# Altium schematic sheet PM12_LDO.SchDoc: FIT_PM12 board
size 420 x 297 mm; CheckedBy: G.Kasprowicz; Author: INR Moscow; CompanyName: WUT ISE; DrawnBy: M.Podgórski; Organization: WUT ISE; Address1: PW ISE; Address2: Nowowiejska 15/19 00-665 Warsaw; Address3: gkasprow@gmail.com; DocumentNumber: 12; Revision: 2; SheetNumber: 14; SheetTotal: 34; ModifiedBy: -; CheckedDate: -; Title2: LDOs; DivGrp: WUT ISE; Designer: INR RAS; ModifiedDate: -; ProjectName: Sensor Box
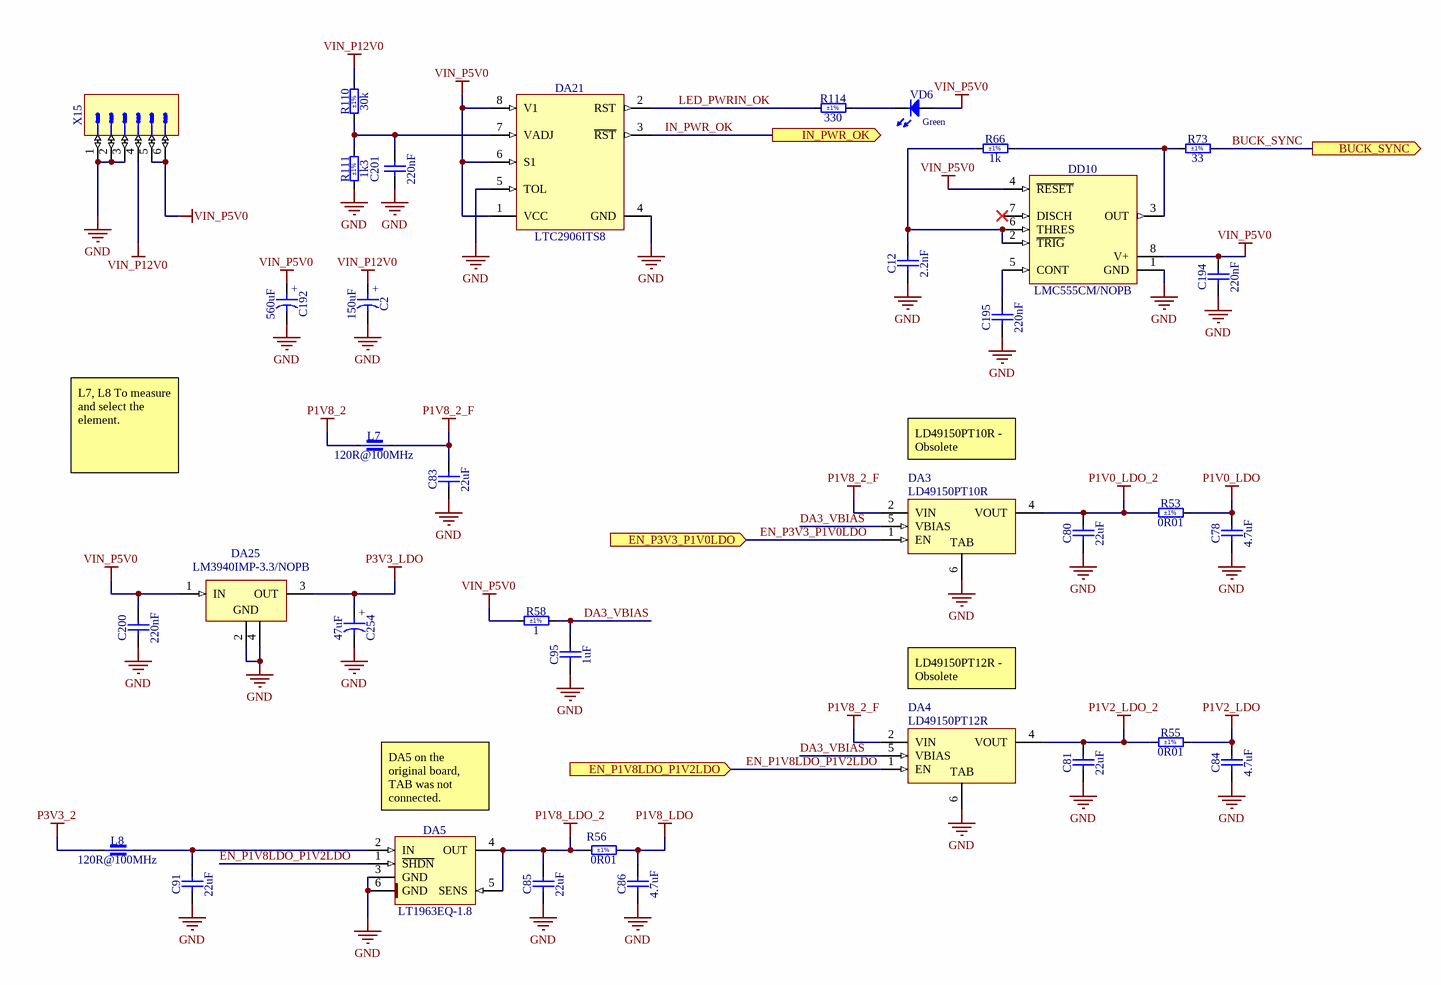
[diagram p0: PM12_LDO.SchDoc]

## Parts
C2  150uF  [CAPAE830X1020N]
C12  2.2nF  [CAPC2013X100N]
C78  4.7uF  [CAPC2012X145N]
C80  22uF  [CAPC3216X180N]
C81  22uF  [CAPC3216X180N]
C83  22uF  [CAPC3216X180N]
C84  4.7uF  [CAPC2012X145N]
C85  22uF  [CAPC3216X180N]
C86  4.7uF  [CAPC2012X145N]
C91  22uF  [CAPC3216X180N]
C95  1uF  [CAPC2012X140N]
C192  560uF  [CAPAE830X1020N]
C194  220nF  [CAPC2012X135N]
C195  220nF  [CAPC2012X135N]
C200  220nF  [CAPC2012X135N]
C201  220nF  [CAPC2012X135N]
C254  47uF  [CAPAE530X610N]
DA3  LD49150PT10R  [PPAK_N]
DA4  LD49150PT12R  [PPAK_M]
DA5  LT1963EQ-1.8  [TO170P1394X457-6N-R900X1060]
DA21  LTC2906ITS8  [SOT65P280X100-8N]
DA25  LM3940IMP-3.3/NOPB  [SOT230P700X180-4N]
DD10  LMC555CM/NOPB  [SOIC127P600X175-8N]
L7  120R@100MHz  [IND_MURATA_BLM31KN]
L8  120R@100MHz  [IND_MURATA_BLM31KN]
R53  0R01  Tolerance: ±1%  [RESC3216X80N]
R55  0R01  Tolerance: ±1%  [RESC3216X80N]
R56  0R01  Tolerance: ±1%  [RESC3216X80N]
R58  1  Tolerance: ±1%  [RESC2012X60N]
R66  1k  Tolerance: ±1%  [RESC2012X60N]
R73  33  Tolerance: ±1%  [RESC2012X60N]
R110  30k  Tolerance: ±1%  [RESC2012X60N]
R111  1k3  Tolerance: ±1%  [RESC2012X60N]
R114  330  Tolerance: ±1%  [RESC2012X60N]
VD6  Green  [LED_KINGBRIGHT_KP-2012LSGC]
X15  Mini-Fit BMI  [MOLEX_15-24-9067]  (value not drawn)

## Ports
BUCK_SYNC (out), EN_P1V8LDO_P1V2LDO (in), EN_P3V3_P1V0LDO (in), IN_PWR_OK (out)

## Nets
GND: C2.2 C12.1 C78.1 C80.1 C81.1 C83.1 C84.1 C85.1 C86.1 C91.1 C95.1 C192.2 C194.1 C195.1 C200.1 C201.1 C254.2 DA3.6(TAB) DA4.6(TAB) DA5.3(GND) DA5.6(GND) DA21.4(GND) DA21.5(TOL) DA25.2(GND) DA25.4(GND) DD10.1(GND) R111.1 X15.1 X15.2 X15.3
P1V0_LDO: C78.2 R53.2
P1V0_LDO_2: C80.2 DA3.4(VOUT) R53.1
P1V2_LDO: C84.2 R55.2
P1V2_LDO_2: C81.2 DA4.4(VOUT) R55.1
P1V8_2: L7.1
P1V8_2_F: C83.2 DA3.2(VIN) DA4.2(VIN) L7.2
P1V8_LDO: C86.2 R56.2
P1V8_LDO_2: C85.2 DA5.4(OUT) DA5.5(SENS) R56.1
P3V3_2: L8.1
P3V3_LDO: C254.1 DA25.3(OUT)
VIN_P5V0: C192.1 C194.2 C200.2 DA21.1(VCC) DA21.6(S1) DA21.8(V1) DA25.1(IN) DD10.4(~{RESET}) DD10.8(V+) R58.1 VD6.2(A) X15.5 X15.6
VIN_P12V0: C2.1 R110.2 X15.4
BUCK_SYNC: R73.2 ; port BUCK_SYNC
DA3_VBIAS: C95.2 DA3.5(VBIAS) DA4.5(VBIAS) R58.2
EN_P1V8LDO_P1V2LDO: DA4.1(EN) DA5.1(~{SHDN}) ; port EN_P1V8LDO_P1V2LDO
EN_P3V3_P1V0LDO: DA3.1(EN) ; port EN_P3V3_P1V0LDO
IN_PWR_OK: DA21.3(~{RST}) ; port IN_PWR_OK
LED_PWRIN_OK: DA21.2(RST) R114.1
NetC12_2: C12.2 DD10.2(~{TRIG}) DD10.6(THRES) R66.1
NetC91_2: C91.2 DA5.2(IN) L8.2
NetC195_2: C195.2 DD10.5(CONT)
NetC201_2: C201.2 DA21.7(VADJ) R110.1 R111.2
NetDD10_3: DD10.3(OUT) R66.2 R73.1
NetR114_2: R114.2 VD6.1(C)

Not connected (* = marked no-connect by the designer): DD10 7(DISCH)*

## Notes on the sheet
- L7, L8 To measure and select the element.
- LD49150PT10R - Obsolete
- LD49150PT12R - Obsolete
- (near DA5) DA5 on the original board, TAB was not connected.
- Project/Equipment
- Document
- Designer
- Drawn by
- Check.by
- Copyright WUT ISE 2024.
  This documentation describes Open Hardware and is licensed under the CERN OHL v.2. You may redistribute and modify this documentation under the terms of the CERN OHL v.2. (http://ohwr.org/CERNOHL). This documentation is distributed WITHOUT ANY EXPRESS OR IMPLIED WARRANTY, INCLUDING OF MERCHANTABILITY, SATISFACTORY QUALITY AND FITNESS FOR A PARTICULAR PURPOSE. Please see the CERN OHL v.2 for applicable conditions.
- Contact
- File
- Last Mod.
- Print Date
- Sheet
- Size
- A3
- of
- Rev
- (in symbol CAE530-610_47UF_16V_20%) +
- (in symbol CAE830-1020_150UF_25V_20%) +
- (in symbol CAE830-1020_560UF_10V_20%) +

## Library data of the parts
C2 = CAE830-1020_150UF_25V_20%: Polarised capacitor; Part Description: Aluminum Electrolytic SMT Capacitor; Manufacturer: PANASONIC; Manufacturer Part Number: EEEFP1E151AP; Voltage: 25V; Tolerance: ±20%; Part Number: CAE830-1020_150UF_25V_20%; Component Kind: Standard; Component Type: Standard; Pin Count: 2; Value: 150uF; Status: Not Recommended; Case: F; Mounted: Yes; Socket: No; SMD: Yes; Sense: No; ComponentHeight: 10.2mm; HelpURL: \\cern.ch\dfs\Applications\Altium\Datasheets\CAE_PANASONIC_FP.pdf; Author: CERN DEM HF; CreateDate: 24.05.2024; LatestRevisionDate: 24.05.2024
C12 = CC0805_2.2NF_50V_5%_C0G: Non-polarised capacitor; Part Description: SMD Multilayer Chip Ceramic Capacitor; Manufacturer: GENERIC; Manufacturer1 Part Number: C0805C222J5GACTU; Voltage: 50V; TC: C0G/NP0; Tolerance: ±5%; Part Number: CC0805_2.2NF_50V_5%_C0G; Component Kind: Standard; Component Type: Standard; Pin Count: 2; Value: 2.2nF; Status: None; Manufacturer Part Number: CC0805_2.2NF_50V_5%_C0G; Case: 0805; Mounted: Yes; Socket: No; SMD: Yes; Sense: No; Manufacturer1 Example: KEMET; Manufacturer1 ComponentHeight: 0.88mm; HelpURL: \\cern.ch\dfs\Applications\Altium\Datasheets\CC0805_C0G_KEMET_(Commercial Grade).pdf; Author: CERN DEM MR; CreateDate: 26.01.2016; LatestRevisionDate: 26.01.2016
C78 C84 C86 = CC0805_4.7UF_50V_10%_X7R: Non-polarised capacitor; Part Description: SMD Multilayer Chip Ceramic Capacitor; Manufacturer: GENERIC; Manufacturer1 Part Number: C2012X7R1H475K125; Voltage: 50V; TC: X7R; Tolerance: ±10%; Part Number: CC0805_4.7UF_50V_10%_X7R; Component Kind: Standard; Component Type: Standard; Pin Count: 2; Value: 4.7uF; Status: Preferred; Manufacturer Part Number: CC0805_4.7UF_50V_10%_X7R; Case: 0805; Mounted: Yes; Socket: No; SMD: Yes; Sense: No; Manufacturer1 Example: TDK; Manufacturer1 ComponentHeight: 1.45mm; HelpURL: \\cern.ch\dfs\Applications\Altium\Datasheets\CC0805_X7R_TDK_C.pdf; Author: CERN DEM JMW; CreateDate: 30.07.2021; LatestRevisionDate: 30.07.2021
C80 C81 C83 C85 C91 = CC1206_22UF_25V_20%_X5R: Non-polarised capacitor; Part Description: SMD Multilayer Chip Ceramic Capacitor; Manufacturer: GENERIC; Manufacturer1 Part Number: C3216X5R1E226M160; Voltage: 25V; TC: X5R; Tolerance: ±20%; Part Number: CC1206_22UF_25V_20%_X5R; Component Kind: Standard; Component Type: Standard; Pin Count: 2; Value: 22uF; Status: None; Manufacturer Part Number: CC1206_22UF_25V_20%_X5R; Case: 1206; Mounted: Yes; Socket: No; SMD: Yes; Sense: No; Manufacturer1 Example: TDK; Manufacturer1 ComponentHeight: 1.8mm; HelpURL: \\cern.ch\dfs\Applications\Altium\Datasheets\CC1206_X5R_TDK_C.pdf; Author: CERN DEM WB; CreateDate: 25.07.2018; LatestRevisionDate: 25.07.2018
C95 = CC0805_1UF_25V_10%_X7R: Non-polarised capacitor; Part Description: SMD Multilayer Chip Ceramic Capacitor; Manufacturer: GENERIC; Manufacturer1 Part Number: C0805C105K3RAC; Voltage: 25V; TC: X7R; Tolerance: ±10%; Part Number: CC0805_1UF_25V_10%_X7R; Component Kind: Standard; Component Type: Standard; Pin Count: 2; Value: 1uF; Status: Preferred; Manufacturer Part Number: CC0805_1UF_25V_10%_X7R; Case: 0805; Mounted: Yes; Socket: No; SMD: Yes; Sense: No; Manufacturer1 Example: KEMET; Manufacturer1 ComponentHeight: 1.4mm; HelpURL: \\cern.ch\dfs\Applications\Altium\Datasheets\CC0805_X7R_KEMET.pdf; Author: CERN DEM JLC; CreateDate: 23.03.2009; LatestRevisionDate: 23.03.2009
C192 = CAE830-1020_560UF_10V_20%: Polarised capacitor; Part Description: Aluminum Electrolytic SMT Capacitor; Manufacturer: PANASONIC; Manufacturer Part Number: EEEFH1A561L; Voltage: 10V; Tolerance: ±20%; Part Number: CAE830-1020_560UF_10V_20%; Component Kind: Standard; Component Type: Standard; Pin Count: 2; Value: 560uF; Status: Not Recommended; Case: F; Mounted: Yes; Socket: No; SMD: Yes; Sense: No; ComponentHeight: 10.2mm; HelpURL: \\cern.ch\dfs\Applications\Altium\Datasheets\CAE_PANASONIC_FH.pdf; Author: CERN DEM HF; CreateDate: 24.05.2024; LatestRevisionDate: 24.05.2024
C194 C195 C200 C201 = CC0805_220NF_50V_10%_X7R: Non-polarised capacitor; Part Description: SMD Multilayer Chip Ceramic Capacitor; Manufacturer: GENERIC; Manufacturer1 Part Number: GRM21BR71H224KA01L; Voltage: 50V; TC: X7R; Tolerance: ±10%; Part Number: CC0805_220NF_50V_10%_X7R; Component Kind: Standard; Component Type: Standard; Pin Count: 2; Value: 220nF; Status: Preferred; Manufacturer Part Number: CC0805_220NF_50V_10%_X7R; Case: 0805; Mounted: Yes; Socket: No; SMD: Yes; Sense: No; Manufacturer1 Example: MURATA; Manufacturer1 ComponentHeight: 1.35mm; HelpURL: \\cern.ch\dfs\Applications\Altium\Datasheets\CC0805_X7R_MURATA.pdf; Author: CERN DEM JLC; CreateDate: 03.12.2007; LatestRevisionDate: 03.12.2007
C254 = CAE530-610_47UF_16V_20%: Polarised capacitor; Part Description: Conductive Polymer Hybrid Aluminum Electrolytic Capacitor; Manufacturer: CHEMI-CON; Manufacturer Part Number: HHXD160ARA470ME61G; Voltage: 16V; Tolerance: ±20%; Part Number: CAE530-610_47UF_16V_20%; Component Kind: Standard; Component Type: Standard; Pin Count: 2; Value: 47uF; Status: Not Recommended; Case: C; Mounted: Yes; Socket: No; SMD: Yes; Sense: No; ComponentHeight: 6.1mm; HelpURL: \\cern.ch\dfs\Applications\Altium\Datasheets\CAE_CHIMI-CON_HXD.pdf; Author: CERN DEM HF; CreateDate: 15.04.2024; LatestRevisionDate: 15.04.2024
DA3 = CMP-0244-00092-1: 1.5 Very Low Drop Voltage Regulator, 1.0V, 5-Pin PPAK, Tape and Reel; ComponentLink1URL: http://www.st.com; ComponentLink2Description: Datasheet; PackageVersion: 1/06/2004; DatasheetVersion: 1/06/2010; PackageDescription: 5-Pin Transistor Outline Package 1.27 mm Pitch, 9.7 mm Lead Span; ComponentLink1Description: Manufacturer URL; ComponentLink2URL: http://www.st.com/internet/com/TECHNICAL_RESOURCES/TECHNICAL_LITERATURE/DATASHEET/CD00157522.pdf; PackageReference: PPAK
DA4 = CMP-0244-00093-1: 1.5 Very Low Drop Voltage Regulator, 1.2V, 5-Pin PPAK, Tape and Reel; ComponentLink2URL: http://www.st.com/internet/com/TECHNICAL_RESOURCES/TECHNICAL_LITERATURE/DATASHEET/CD00157522.pdf; DatasheetVersion: 1/06/2010; ComponentLink1Description: Manufacturer URL; ComponentLink2Description: Datasheet; ComponentLink1URL: http://www.st.com; PackageDescription: 5-Pin Transistor Outline Package 1.27 mm Pitch, 9.7 mm Lead Span; PackageReference: PPAK; PackageVersion: 1/06/2004
DA5 = LT1963EQ-1.8: 1.5A, Fast Transient Response LDO Regulators; Part Description: 1.5A, 1.8V, Fast Transient Response, LDO Regulator; Manufacturer: ANALOG DEVICES; PressFit: No; Bonding: No; Part Number: LT1963EQ-1.8; Component Kind: Standard; Component Type: Standard; Device: LT1963EQ-1.8; PackageDescription: D2PAK TO-263, TO, 1.70mm Pitch; 5 Pin, 13.945mm L X 8.89mm W X 4.572mm H body, IPC Medium Density; Manufacturer Part Number: LT1963EQ-1.8; Pin Count: 6; Case: TO-263-5; Mounted: Yes; Socket: No; SMD: Yes; Sense: No; ComponentHeight: 4.57mm; HelpURL: \\cern.ch\dfs\Applications\Altium\Datasheets\LT1963.pdf; Author: CERN DEM HF; CreateDate: 05.06.2024; LatestRevisionDate: 05.06.2024
DA21 = LTC2906ITS8: Precision Dual Supply Monitors with One Pin-Selectable Threshold and One Adjustable Input; Manufacturer: LINEAR TECHNOLOGY; PressFit: No; Bonding: No; Part Number: LTC2906ITS8; Component Kind: Standard; Component Type: Standard; Device: LTC2906ITS8; PackageDescription: SOT, 0.65mm Pitch; 8 Pin, 1.625mm W X 2.90mm L X 1.00mm H Body, IPC Medium Density; Part Description: Precision Dual Supply Monitors with One Pin-Selectable Threshold and One Adjustable Input; Manufacturer Part Number: LTC2906ITS8; Pin Count: 8; Case: SOT23-8; Mounted: Yes; Socket: No; SMD: Yes; Sense: No; ComponentHeight: 1mm; Author: CERN DEM HF; HelpURL: \\cern.ch\dfs\Applications\Altium\Datasheets\LTC2906.pdf; CreateDate: 05.06.2024; LatestRevisionDate: 05.06.2024
DA25 = LM3940IMP-3.3/NOPB: 3-Terminal Regulator 1=IN 2=GND 3=OUT 4=GND; Part Description: 1A Low Dropout Regulator for 5V to 3.3V Conversion; Manufacturer: TEXAS INSTRUMENTS; PressFit: No; Bonding: No; Part Number: LM3940IMP-3.3/NOPB; Component Kind: Standard; Component Type: Standard; Device: LM3940IMP-3.3/NOPB; PackageDescription: SOT223, 2.30mm Pitch; 4 Pin, 3.70mm W X 6.70mm L X 1.80mm H body, IPC Medium Density; Manufacturer Part Number: LM3940IMP-3.3; Pin Count: 4; Case: SOT223; Mounted: Yes; Socket: No; SMD: Yes; Sense: No; ComponentHeight: 1.8mm; HelpURL: \\cern.ch\dfs\Applications\Altium\Datasheets\LM3940IMP-3.3-NOPB.pdf; Author: CERN DEM JLC; CreateDate: 28.03.2011; LatestRevisionDate: 01.06.2022
DD10 = LMC555CM/NOPB: CMOS Timer; Manufacturer: NATIONAL SEMICONDUCTOR; PressFit: No; Bonding: No; Part Number: LMC555CM/NOPB; Component Kind: Standard; Component Type: Standard; Device: LMC555CM/NOPB; PackageDescription: SOIC 8, Pitch 1.27mm, Body 4x5mm, IPC Medium Density; Part Description: CMOS Timer; Manufacturer Part Number: LMC555CM; Pin Count: 8; Case: SOIC8; Mounted: Yes; Socket: No; SMD: Yes; Sense: No; ComponentHeight: 1.75mm; Author: CERN DEM JLC; HelpURL: \\cern.ch\dfs\Applications\Altium\Datasheets\LMC555C-NOPB.pdf; CreateDate: 12.04.2010; LatestRevisionDate: 01.06.2022
L7 L8 = IND1206_MURATA_BLM31KN121SN1: Part Description: SMD Chip Ferrite Bead, BLM31KN_SN Series; Manufacturer: MURATA; Power: 6A; Resistance: 0.009R; Tolerance: ±25%; Part Number: IND1206_MURATA_BLM31KN121SN1; Component Kind: Standard; Component Type: Standard; Footprint: IND_MURATA_BLM31KN1; Pin Count: 2; Value: 120R@100MHz; Manufacturer Part Number: BLM31KN121SN1; Case: 1206; Mounted: Yes; Socket: No; SMD: Yes; Sense: No; ComponentHeight: 1.8mm; HelpURL: \\cern.ch\dfs\Applications\Altium\Datasheets\IND1206_MURATA_ BLM31KN_SN.pdf; Author: CERN DEM HF; CreateDate: 05.01.2022; LatestRevisionDate: 05.01.2022
R53 R55 R56 = R1206_0R01_1%_1W_100PPM_TT_LRMAM1206: Resistor - 1%; Part Description: Low Value Metal Alloy Resistor; Manufacturer: TT Electronics; Manufacturer Part Number: LRMAM1206-R01FT5; Power: 1W; TC: ±100ppm/°C; PressFit: No; Part Number: R1206_0R01_1%_1W_100PPM_TT_LRMAM1206; Component Kind: Standard; Component Type: Standard; Pin Count: 2; Value: 0R01; Status: Not Recommended; Case: 1206; Mounted: Yes; Sense: No; Socket: No; SMD: Yes; ComponentHeight: 0.8mm; HelpURL: \\cern.ch\dfs\Applications\Altium\Datasheets\R1206_TT ELECTRONICS_LRMA.pdf; Author: CERN DEM BC; CreateDate: 29.07.2015; LatestRevisionDate: 29.07.2015
R58 = R0805_1R_1%_0.125W_100PPM: Resistor - 1%; Part Description: Thick Film Chip Resistor; Manufacturer: GENERIC; Manufacturer1 Part Number: CRCW08051R00FKEA; Power: 0.125W; TC: ±100ppm/°C; PressFit: No; Part Number: R0805_1R_1%_0.125W_100PPM; Component Kind: Standard; Component Type: Standard; Pin Count: 2; Value: 1; Status: None; Manufacturer Part Number: R0805_1R_1%_0.125W_100PPM; Case: 0805; Mounted: Yes; Sense: No; Socket: No; SMD: Yes; Manufacturer1 Example: VISHAY; Manufacturer1 ComponentHeight: 0.6mm; HelpURL: \\cern.ch\dfs\Applications\Altium\Datasheets\R0805_VISHAY_CRCW e3.pdf; Author: CERN DEM HF; CreateDate: 07.06.2024; LatestRevisionDate: 07.06.2024
R66 = R0805_1K_1%_0.125W_100PPM: Resistor - 1%; Part Description: General Purpose Thick Film Chip Resistor; Manufacturer: GENERIC; Manufacturer1 Part Number: NRC10F1001TRF; Power: 0.125W; TC: ±100ppm/°C; PressFit: No; Part Number: R0805_1K_1%_0.125W_100PPM; Component Kind: Standard; Component Type: Standard; Pin Count: 2; Value: 1k; Status: Preferred; Manufacturer Part Number: R0805_1K_1%_0.125W_100PPM; Case: 0805; Mounted: Yes; Sense: No; Socket: No; SMD: Yes; Manufacturer1 Example: NIC COMPONENT; Manufacturer1 ComponentHeight: 0.6mm; HelpURL: \\cern.ch\dfs\Applications\Altium\Datasheets\R0805_NIC_NRC.pdf; Author: CERN DEM JLC; CreateDate: 03.12.2007; LatestRevisionDate: 13.03.2008
R73 = R0805_33R_1%_0.125W_100PPM: Resistor - 1%; Part Description: General Purpose Thick Film Chip Resistor; Manufacturer: GENERIC; Manufacturer1 Part Number: NRC10F33R0TRF; Power: 0.125W; TC: ±100ppm/°C; PressFit: No; Part Number: R0805_33R_1%_0.125W_100PPM; Component Kind: Standard; Component Type: Standard; Pin Count: 2; Value: 33; Status: Preferred; Manufacturer Part Number: R0805_33R_1%_0.125W_100PPM; Case: 0805; Mounted: Yes; Sense: No; Socket: No; SMD: Yes; Manufacturer1 Example: NIC COMPONENT; Manufacturer1 ComponentHeight: 0.6mm; HelpURL: \\cern.ch\dfs\Applications\Altium\Datasheets\R0805_NIC_NRC.pdf; Author: CERN DEM JLC; CreateDate: 03.12.2007; LatestRevisionDate: 13.03.2008
R110 = R0805_30K_1%_0.125W_100PPM: Resistor - 1%; Part Description: General Purpose Thick Film Chip Resistor; Manufacturer: GENERIC; Manufacturer1 Part Number: NRC10F3002TRF; Power: 0.125W; TC: ±100ppm/°C; PressFit: No; Part Number: R0805_30K_1%_0.125W_100PPM; Component Kind: Standard; Component Type: Standard; Pin Count: 2; Value: 30k; Status: Preferred; Manufacturer Part Number: R0805_30K_1%_0.125W_100PPM; Case: 0805; Mounted: Yes; Sense: No; Socket: No; SMD: Yes; Manufacturer1 Example: NIC COMPONENT; Manufacturer1 ComponentHeight: 0.6mm; HelpURL: \\cern.ch\dfs\Applications\Altium\Datasheets\R0805_NIC_NRC.pdf; Author: CERN DEM JLC; CreateDate: 03.12.2007; LatestRevisionDate: 13.03.2008
R111 = R0805_1K3_1%_0.125W_100PPM: Resistor - 1%; Part Description: General Purpose Thick Film Chip Resistor; Manufacturer: GENERIC; Manufacturer1 Part Number: NRC10F1301TRF; Power: 0.125W; TC: ±100ppm/°C; PressFit: No; Part Number: R0805_1K3_1%_0.125W_100PPM; Component Kind: Standard; Component Type: Standard; Pin Count: 2; Value: 1k3; Status: Preferred; Manufacturer Part Number: R0805_1K3_1%_0.125W_100PPM; Case: 0805; Mounted: Yes; Sense: No; Socket: No; SMD: Yes; Manufacturer1 Example: NIC COMPONENT; Manufacturer1 ComponentHeight: 0.6mm; HelpURL: \\cern.ch\dfs\Applications\Altium\Datasheets\R0805_NIC_NRC.pdf; Author: CERN DEM JLC; CreateDate: 03.12.2007; LatestRevisionDate: 13.03.2008
R114 = R0805_330R_1%_0.125W_100PPM: Resistor - 1%; Part Description: General Purpose Thick Film Chip Resistor; Manufacturer: GENERIC; Manufacturer1 Part Number: NRC10F3300TRF; Power: 0.125W; TC: ±100ppm/°C; PressFit: No; Part Number: R0805_330R_1%_0.125W_100PPM; Component Kind: Standard; Component Type: Standard; Pin Count: 2; Value: 330; Status: Preferred; Manufacturer Part Number: R0805_330R_1%_0.125W_100PPM; Case: 0805; Mounted: Yes; Sense: No; Socket: No; SMD: Yes; Manufacturer1 Example: NIC COMPONENT; Manufacturer1 ComponentHeight: 0.6mm; HelpURL: \\cern.ch\dfs\Applications\Altium\Datasheets\R0805_NIC_NRC.pdf; Author: CERN DEM JLC; CreateDate: 03.12.2007; LatestRevisionDate: 13.03.2008
VD6 = LED_KINGBRIGHT_KP-2012LSGC: LED Green 1C 2A; Part Description: 2.0x1.2mm Surface Mount Green LED; PressFit: No; Bonding: No; Part Number: LED_KINGBRIGHT_KP-2012LSGC; Component Kind: Standard; Component Type: Standard; Color: Green; PackageDescription: 2.0x1.2mm Surface Mount Green LED; Manufacturer: KINGBRIGHT; Manufacturer Part Number: KP-2012LSGC; Pin Count: 2; Case: 0805; Mounted: Yes; Socket: No; SMD: Yes; Sense: No; ComponentHeight: 1.1mm; HelpURL: \\cern.ch\dfs\Applications\Altium\Datasheets\LED_KINGBRIGHT_KP-2012LSGC.pdf; Author: CERN DEM BC; CreateDate: 09.11.2020; LatestRevisionDate: 09.11.2020
X15 = MOLEX_15-24-9067: Connector 6 Male; Part Description: Mini-Fit BMI Header, Dual Row, Right-Angle, with Snap-in Plastic Peg PCB Lock, 6 Circuits, Gold (Au) Plating; Manufacturer: MOLEX; PressFit: No; Part Number: MOLEX_15-24-9067; Component Kind: Standard; Component Type: Standard; Pin Count: 6; Family: Mini-Fit BMI; Mounted: Yes; Socket: No; SMD: No; Sense: No; Status: None; Manufacturer Part Number: 15-24-9067; ComponentHeight: 15mm; HelpURL: \\cern.ch\dfs\Applications\Altium\Datasheets\MOLEX_15-24-9067.pdf; Author: CERN DEM HF; CreateDate: 06.06.2024; LatestRevisionDate: 06.06.2024